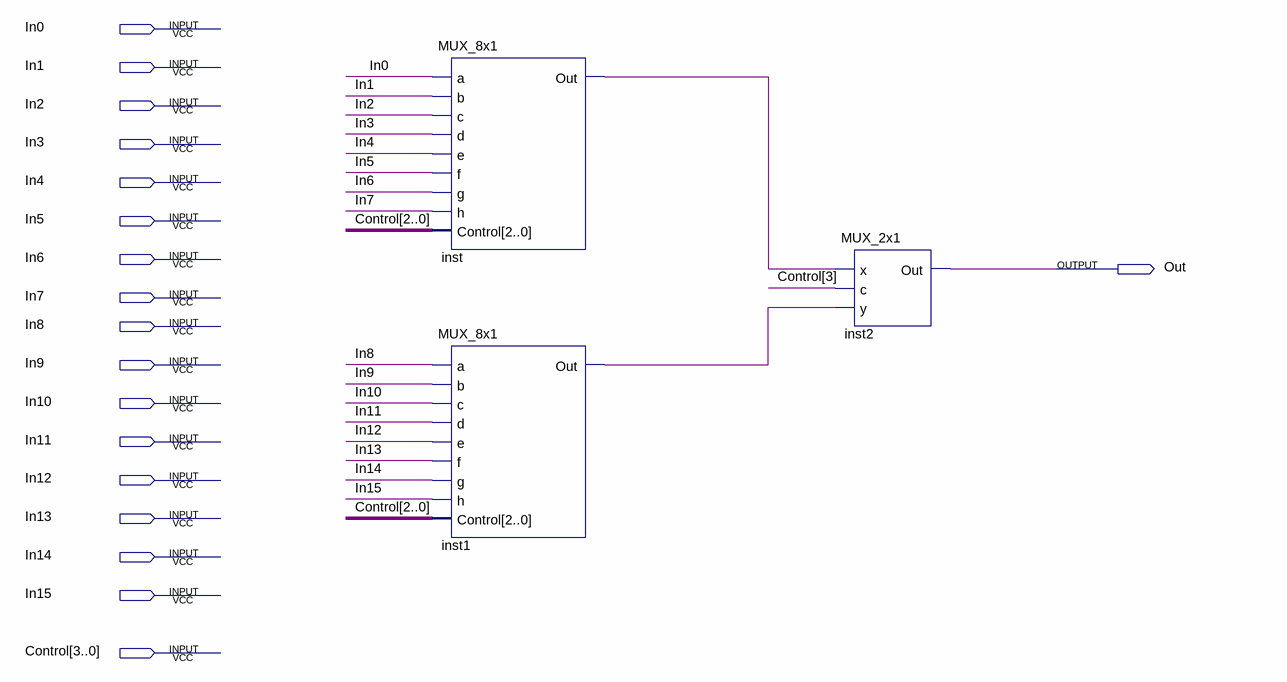
[diagram p0: schematic sheet]
// Quartus schematic MUX_16x1.bdf as structural Verilog: 3 symbols, 18 pins
module MUX_16x1 (
  input  In0,
  input  In1,
  input  In2,
  input  In3,
  input  In4,
  input  In5,
  input  In6,
  input  In7,
  input  In8,
  input  In9,
  input  In10,
  input  In11,
  input  In12,
  input  In13,
  input  In14,
  input  In15,
  input  [3:0] Control,
  output Out
);

  wire inst1_out, inst_out;

  MUX_8x1 inst (
    .a(In0), .b(In1), .c(In2), .d(In3), .e(In4), .f(In5), .g(In6), .h(In7), .Control(Control[2:0]),
    .Out(inst_out));
  MUX_8x1 inst1 (
    .a(In8), .b(In9), .c(In10), .d(In11), .e(In12), .f(In13), .g(In14), .h(In15), .Control(Control[2:0]),
    .Out(inst1_out));
  MUX_2x1 inst2 (.x(inst_out), .c(Control[3]), .y(inst1_out), .Out(Out));
endmodule
